# EAGLE design Battery Shield (EAGLE 6.4)
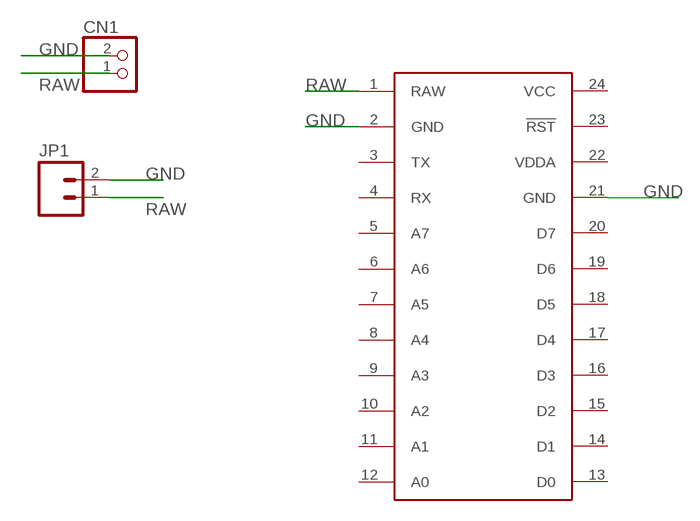
[diagram p0: schematic, sheet 1]

## Parts
CN1  JST_2PIN-THM  [JST-PH-2-THM]
JP1  M02PTH4  [1X02_XTRA_BIG]
U$1  SPARK_CORECORE  [SPARK_CORE]

## Nets
GND: CN1.2 JP1.2 U$1.2(GND) U$1.21(GND)
RAW: CN1.1 JP1.1 U$1.1(RAW)
Unconnected: U$1.3(TX) U$1.4(RX) U$1.5(A7) U$1.6(A6) U$1.7(A5) U$1.8(A4) U$1.9(A3) U$1.10(A2) U$1.11(A1) U$1.12(A0) U$1.13(D0) U$1.14(D1) U$1.15(D2) U$1.16(D3) U$1.17(D4) U$1.18(D5) U$1.19(D6) U$1.20(D7) U$1.23(!RST)

## Power pins joined to a net without a drawn wire
VCC: U$1.24(VCC)
VDDA: U$1.22(VDDA)

## Library data of the parts
CN1 = adafruit:JST_2PIN: JST 2-Pin Connectors of various flavors SMT-RA (S2B-PH-SM4) 4UConnector #17311 SMT (B2B-PH-SM4) THM-RA (S2B-PH) THM (B2B-PH)
JP1 = SparkFun-Connectors:M02: Header 2 Standard 2-pin 0.1" header. Use with straight break away headers (SKU : PRT-00116), right angle break away headers (PRT-00553), swiss pins (PRT-00743), machine pins (PRT-00117), and female headers (PRT-00115). Molex polarized connector foot print use with SKU : PRT-08233 with associated crimp pins and housings.
U$1 = Spark:SPARK_CORE

## Board
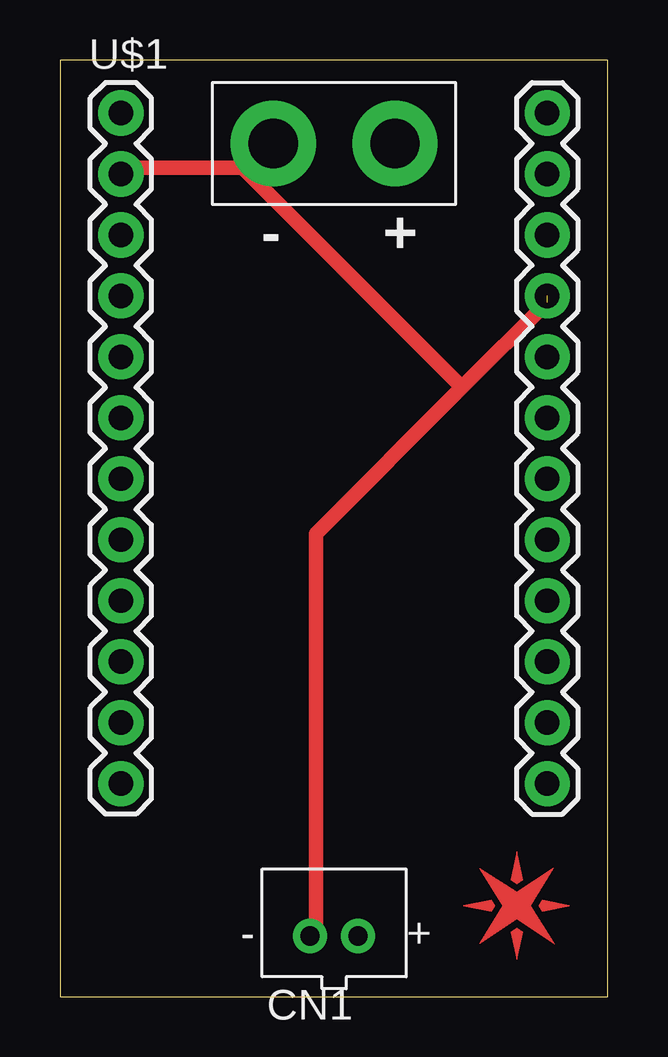
[diagram p1: board, top side]
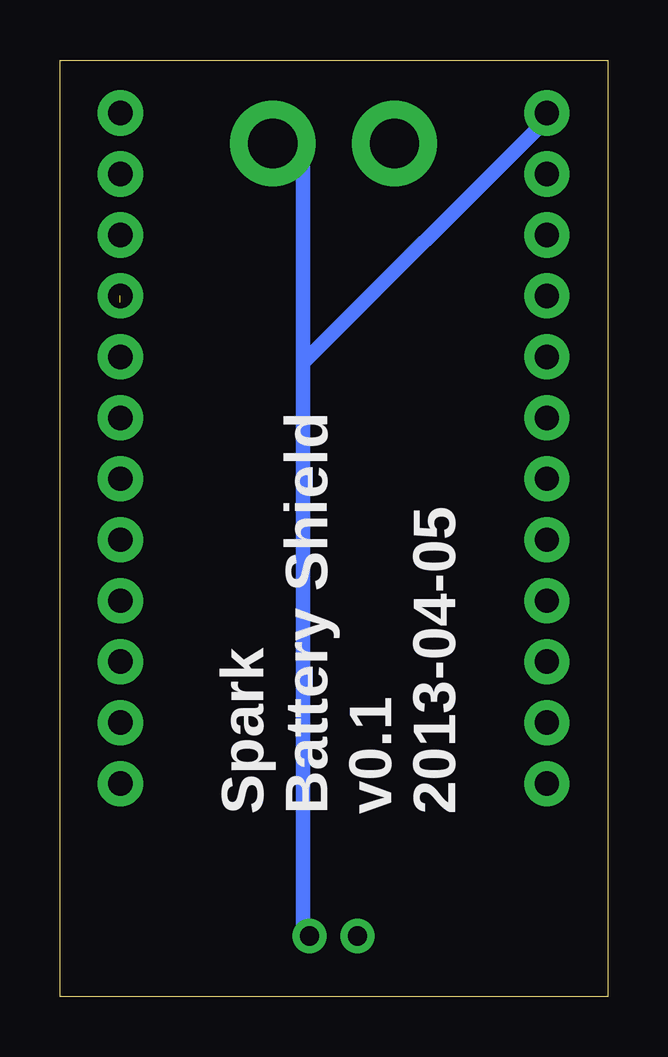
[diagram p2: board, bottom side, seen from below]

Size 22.84 x 39.04 mm. Coordinates in mm from the lower left corner, seen from the top.
Outline: 0,0 22.84,0 22.84,39.04 0,39.04 0,0
Copper layers (1*16): Top 0.035mm / dielectric 1.5mm / Bottom 0.035mm
Design rules "default": minimum track width 10mil, minimum drill 24mil, track to track 8mil, track to pad 8mil, pad to pad 8mil, via to via 8mil, smd to smd 8mil, copper to edge 40mil, drill to drill 8mil, minimum pad ring 10mil, minimum via ring 8mil, stop-mask expansion 4mil, vias tented up to drill 0mil, thermal gap 10mil

### Footprints (pad centres in the part's own frame; a part is rotated, then mirrored left to right if it is on the bottom)
JST-PH-2-THM = drill 0.8 pad 1.422: 1 1,0; 2 -1,0
1X02_XTRA_BIG = drill 2.057 pad 3.556: 1 -2.54,0; 2 2.54,0
SPARK_CORE = drill 1.016 pad 1.88: 1 -8.89,13.97; 2 -8.89,11.43; 3 -8.89,8.89; 4 -8.89,6.35; 5 -8.89,3.81; 6 -8.89,1.27; 7 -8.89,-1.27; 8 -8.89,-3.81; 9 -8.89,-6.35; 10 -8.89,-8.89; 11 -8.89,-11.43; 12 -8.89,-13.97; 13 8.89,-13.97; 14 8.89,-11.43; 15 8.89,-8.89; 16 8.89,-6.35; 17 8.89,-3.81; 18 8.89,-1.27; 19 8.89,1.27; 20 8.89,3.81; 21 8.89,6.35; 22 8.89,8.89; 23 8.89,11.43; 24 8.89,13.97

### Placement (x,y rotation side)
CN1  11.43,2.54 0 top
JP1  11.43,35.56 180 top
U$1  11.43,22.86 0 top
U$2  [SPARK_LOGO_PLUS_PLANE]  19.05,3.81 0 top

### Tracks (layer width: path | path; a pad name or v marks a point on that pad's centre or on a via)
GND  (1 unrouted)
  Top 0.254: 2.54,34.54 U$1.2
  Top 0.61: 7.62,34.54 2.54,34.54 | 7.62,34.54 8.64,35.56 JP1.2 | 20.32,28.96 16.76,25.4 | 16.76,25.4 10.67,19.3 10.67,2.54 CN1.2 | 16.76,25.4 7.62,34.54
RAW
  Bottom 0.254: 2.54,36.58 U$1.1
  Bottom 0.61: 12.7,26.42 12.7,34.54 13.72,35.56 JP1.1 | 12.7,26.42 12.7,2.54 CN1.1 | 12.7,26.42 2.54,36.58

### Text on the board
tPlace: - | +
bPlace: Spark / Battery Shield / v0.1 / 2013-04-05